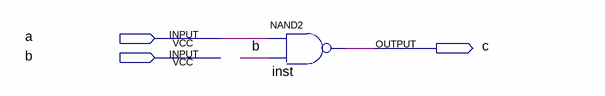
[diagram p0: schematic sheet]
// Quartus schematic lab0.bdf as structural Verilog: 1 symbols, 3 pins
module lab0 (
  input  a,
  input  b,
  output c
);

  nand inst (c, a, b);
endmodule
